# EAGLE design RLB_LTC5510 (EAGLE 9.3.1)
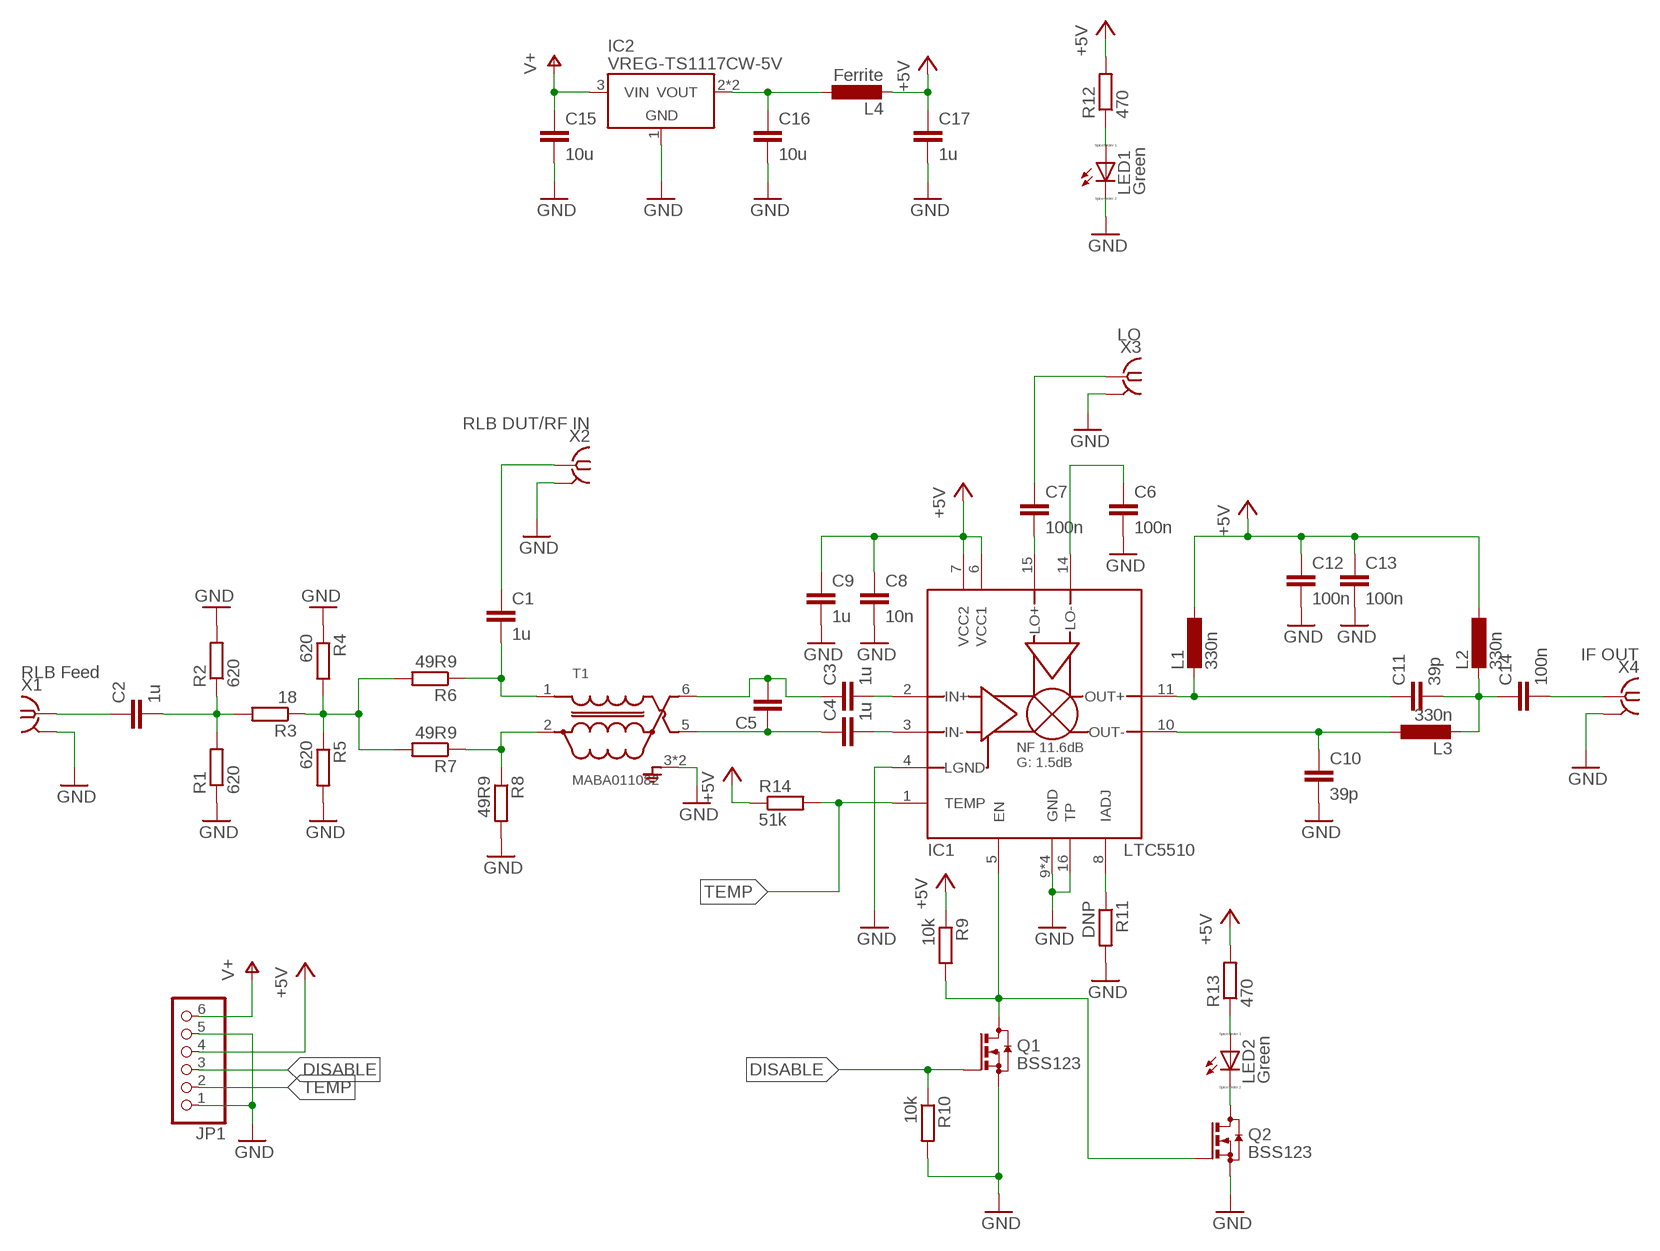
[diagram p0: schematic, sheet 1]

## Parts
C1  1u  C-EUC0603  [C0603]
C2  1u  C-EUC0603  [C0603]
C3  1u  C-EUC0603  [C0603]
C4  1u  C-EUC0603  [C0603]
C5  C-EUC0603  [C0603]
C6  100n  C-EUC0603  [C0603]
C7  100n  C-EUC0603  [C0603]
C8  10n  C-EUC0603  [C0603]
C9  1u  C-EUC0603  [C0603]
C10  39p  C-EUC0603  [C0603]
C11  39p  C-EUC0603  [C0603]
C12  100n  C-EUC0603  [C0603]
C13  100n  C-EUC0603  [C0603]
C14  100n  C-EUC0603  [C0603]
C15  10u  C-EUC1206  [C1206]
C16  10u  C-EUC1206  [C1206]
C17  1u  C-EUC0603  [C0603]
IC1  LTC5510  [QFN65P400X400X75-17T215N]
IC2  VREG-TS1117CW-5V  [SOT223]
JP1  PINHD-1X6/90  [1X06/90]
L1  330n  INDUCTOR0603  [R0603]
L2  330n  INDUCTOR0603  [R0603]
L3  330n  INDUCTOR0603  [R0603]
L4  Ferrite  INDUCTOR0603  [R0603]
LED1  Green  LED_ESML0603  [LED_SML0603]
LED2  Green  LED_ESML0603  [LED_SML0603]
Q1  BSS123  [SOT23]
Q2  BSS123  [SOT23]
R1  620  R-EU_R0603  [R0603]
R2  620  R-EU_R0603  [R0603]
R3  18  R-EU_R0603  [R0603]
R4  620  R-EU_R0603  [R0603]
R5  620  R-EU_R0603  [R0603]
R6  49R9  R-EU_R0603  [R0603]
R7  49R9  R-EU_R0603  [R0603]
R8  49R9  R-EU_R0603  [R0603]
R9  10k  R-EU_R0603  [R0603]
R10  10k  R-EU_R0603  [R0603]
R11  DNP  R-EU_R0603  [R0603]
R12  470  R-EU_R0603  [R0603]
R13  470  R-EU_R0603  [R0603]
R14  51k  R-EU_R0603  [R0603]
T1  MABA011082  [MACOM_BALUN]
X1  RLB Feed  SMA_CONNECTOR  [J502-ND-142-0711-821/826]
X2  RLB DUT/RF IN  SMA_CONNECTOR  [J502-ND-142-0711-821/826]
X3  LO  SMA_CONNECTOR  [J502-ND-142-0711-821/826]
X4  IF OUT  SMA_CONNECTOR  [J502-ND-142-0711-821/826]

## Nets
+5V: C8.1 C9.1 C12.1 C13.1 C17.1 IC1.6(VCC1) IC1.7(VCC2) JP1.4 L1.1 L2.1 L4.2 R9.1 R12.2 R13.2 R14.1
DISABLE: JP1.3 Q1.1(G) R10.1
GND: C6.2 C8.2 C9.2 C10.2 C12.2 C13.2 C15.2 C16.2 C17.2 IC1.4(LGND) IC1.9(GND) IC1.12(GND) IC1.13(GND) IC1.16(TP) IC1.17(GND) IC2.1(GND) JP1.1 JP1.5 LED1.C Q1.2(S) Q2.2(S) R1.1 R2.2 R4.1 R5.2 R8.2 R10.2 R11.2 T1.3(GND) T1.4(GND) X1.G@1 X1.G@2 X1.G@3 X1.G@4 X2.G@1 X2.G@2 X2.G@3 X2.G@4 X3.G@1 X3.G@2 X3.G@3 X3.G@4 X4.G@1 X4.G@2 X4.G@3 X4.G@4
GND1: LED2.C Q2.3(D)
N$1: C2.2 R1.2 R2.1 R3.2
N$2: R3.1 R4.2 R5.1 R6.2 R7.2
N$3: C2.1 X1.1
N$4: C1.2 R6.1 T1.1(PIN1)
N$5: R7.1 R8.1 T1.2(PIN2)
N$6: C1.1 X2.1
N$7: C3.2 IC1.2(IN+)
N$8: C4.2 IC1.3(IN-)
N$9: C4.1 C5.1 T1.5(PIN5)
N$10: C3.1 C5.2 T1.6(PIN6)
N$11: C6.1 IC1.14(LO-)
N$12: C7.2 IC1.15(LO+)
N$13: C7.1 X3.1
N$14: C11.1 IC1.11(OUT+) L1.2
N$15: C10.1 IC1.10(OUT-) L3.1
N$16: C11.2 C14.1 L2.2 L3.2
N$17: C14.2 X4.1
N$18: IC1.5(EN) Q1.3(D) Q2.1(G) R9.2
N$19: IC1.8(IADJ) R11.1
N$20: C16.1 IC2.2(VOUT) IC2.4(VOUT) L4.1
N$21: LED2.A R13.1
N$22: LED1.A R12.1
TEMP: IC1.1(TEMP) JP1.2 R14.2
V+: C15.1 IC2.3(VIN) JP1.6

## Library data of the parts
C1-C17 = rcl:C-EU: CAPACITOR, European symbol
IC1 = rf:LTC5510
IC2 = we-power:VREG: Voltage Regulators (LDOs, Switching Converters...) LDOs Taiwan Semi TS1117 800mA max 15V - compatible On Semi NCP1117 1A max 20V - compatible Diodes AP2111H 0.6A max 6V (0.25V@0.6A) - compatible Diodes AP2114H 1A max 6V (0.45V@1A) Taiwan Semi TS9011 250mA max 12V - compatible Diodes AP2210 300mA max 15V - compatible Microchip MCP1700 250mA max 6.5V - compatible Microchip MCP1702 250mA max 13V - compatible Microchip MCP1703 250mA max 16V - compatible Microchip MCP1754 150mA max 16V Taiwan Semi TS5204 150mA max 16V (low noise) DC/DC Converter Modules Recom R-78Ex.x-1.0-W36 1A max 28V - compatible CUI V78xx-2000 2A max 18V Murata OKI-78SR-x.x/1.5-W36 1.5A max 36V
JP1 = pinhead:PINHD-1X6: PIN HEADER
L1-L4 = rf:INDUCTOR
LED1 LED2 = eagle-ltspice:LED_E: LED Source: http://www.osram.convergy.de Source: www.luxeon.com Source: www.kingbright.com; SPICEMODEL: NONE; SPICEPREFIX: D; SPICETYPE: diode
Q1 Q2 = transistor-small-signal:BSS123: N-CHANNEL MOS FET
R1-R11 R14 = rcl:R-EU_: RESISTOR, European symbol
R12 R13 = resistor:R-EU_: RESISTOR, European symbol
T1 = rf:MABA011082
X1-X4 = rf:SMA_CONNECTOR

## Board
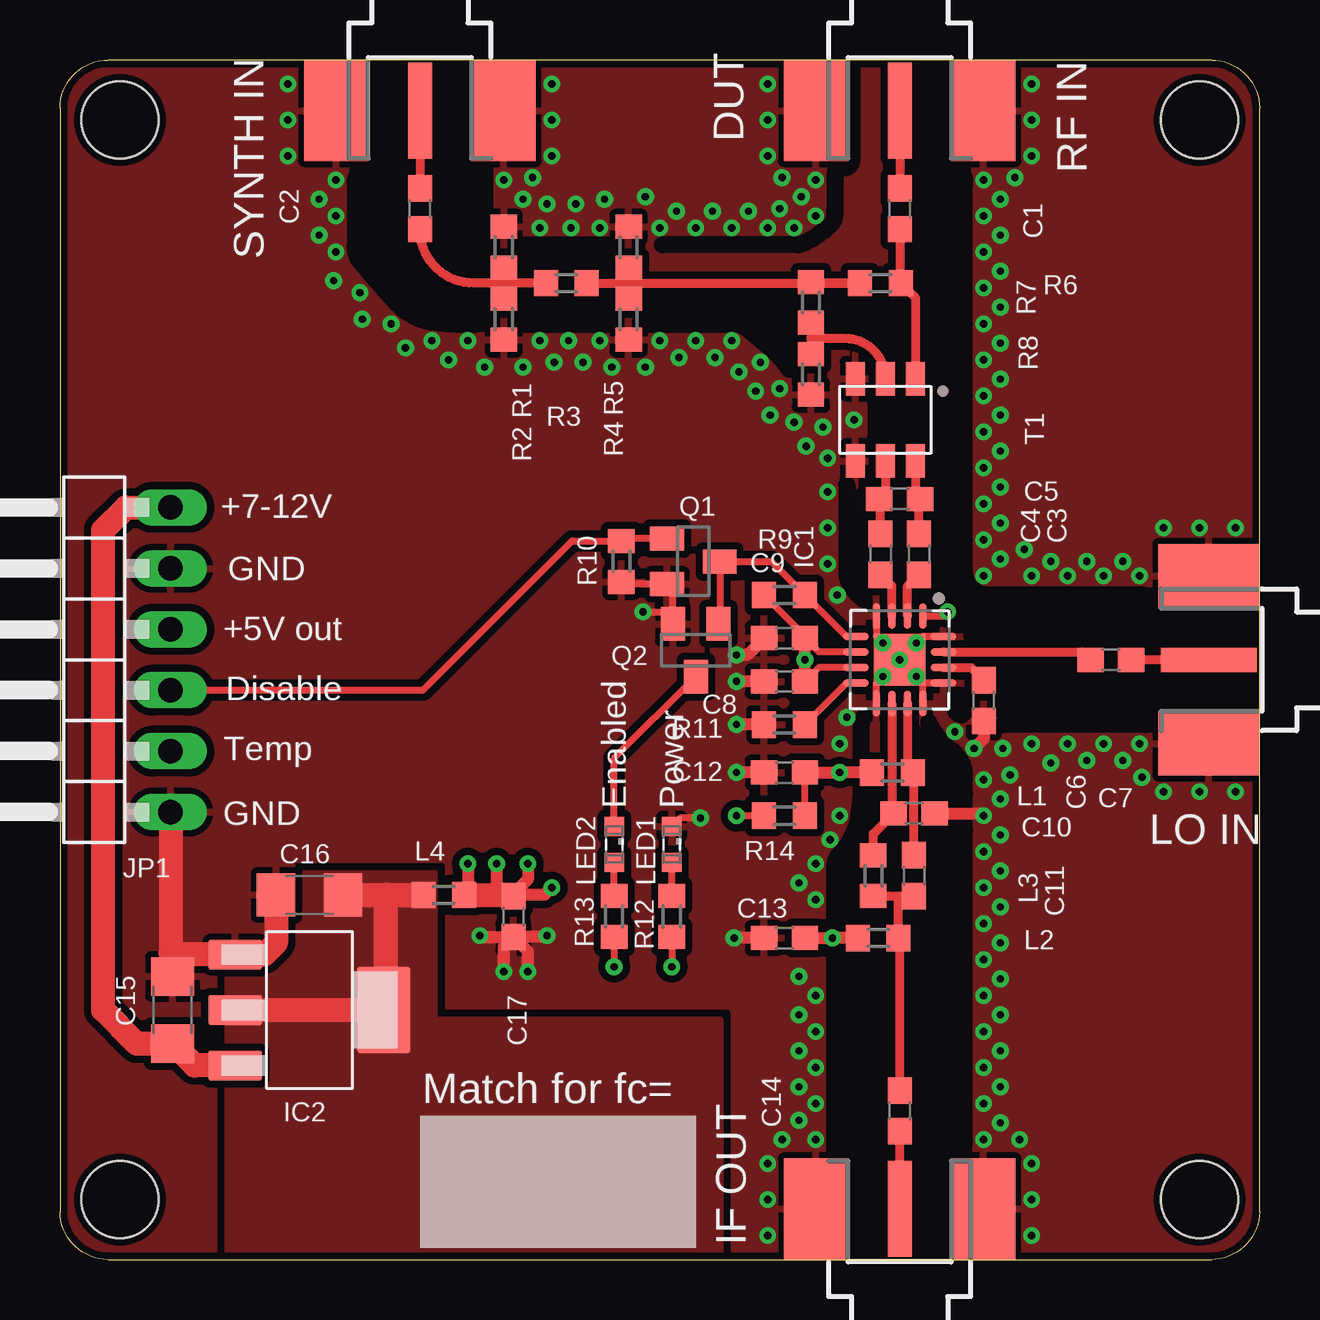
[diagram p1: board, top side]
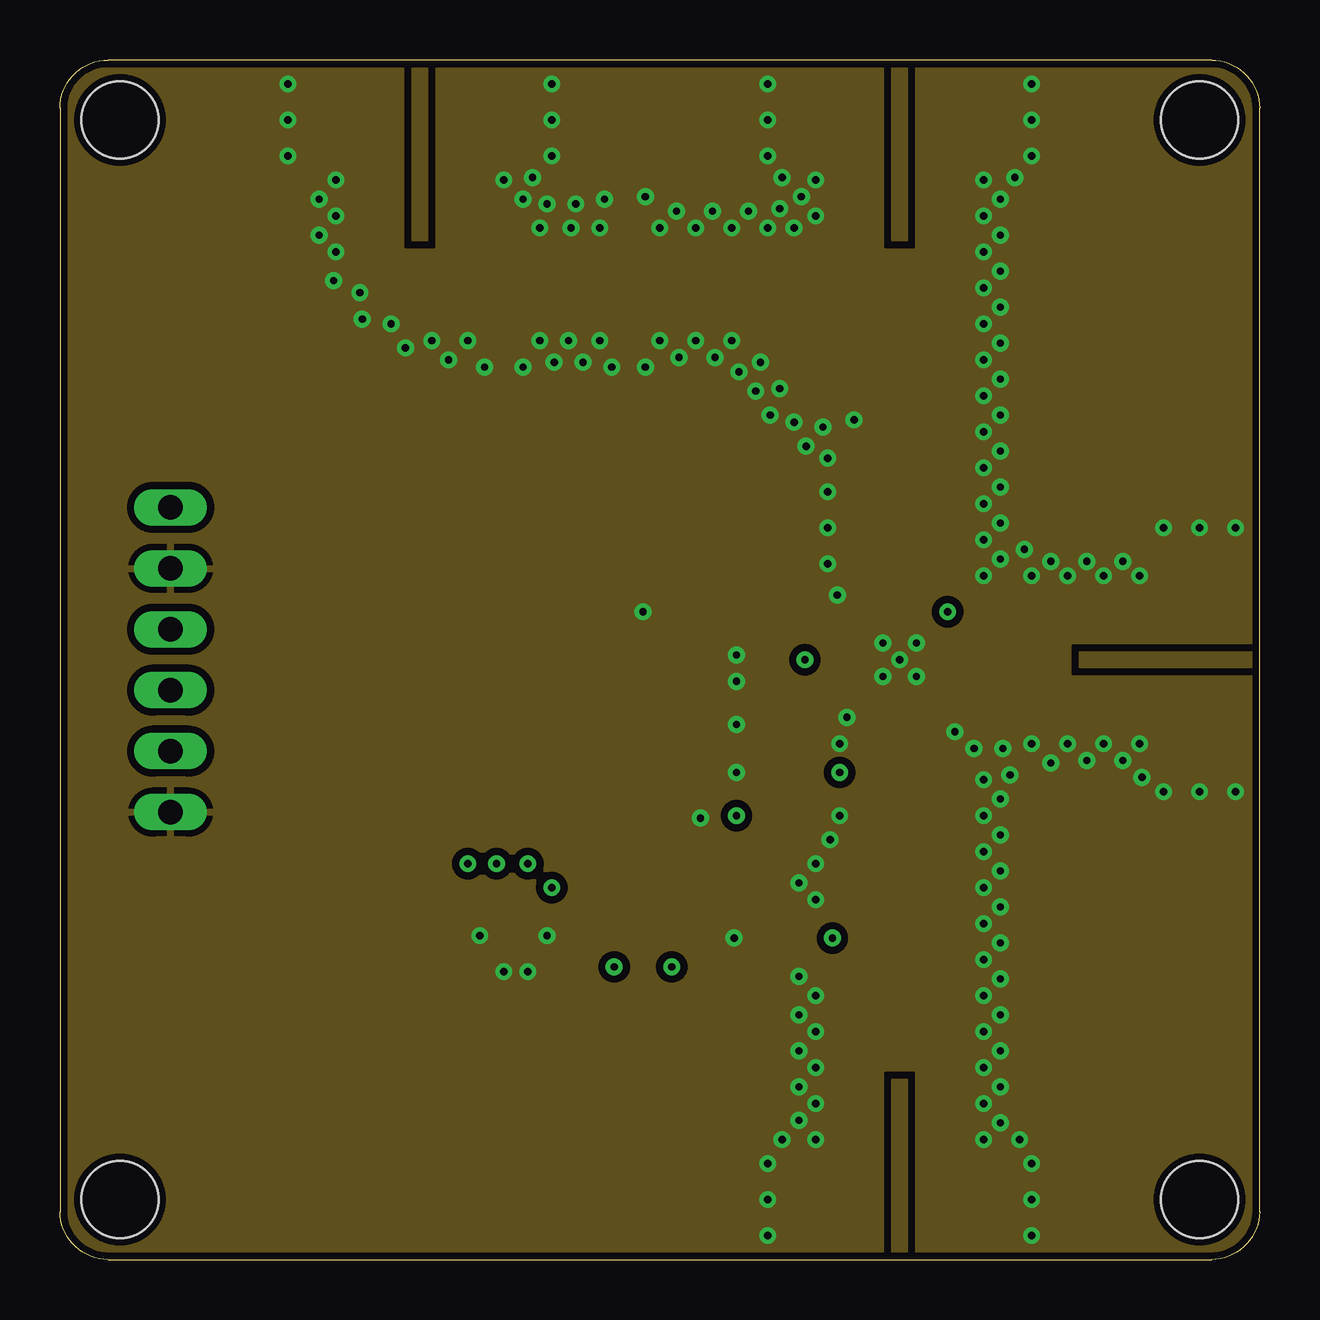
[diagram p2: board, inner layer Route2]
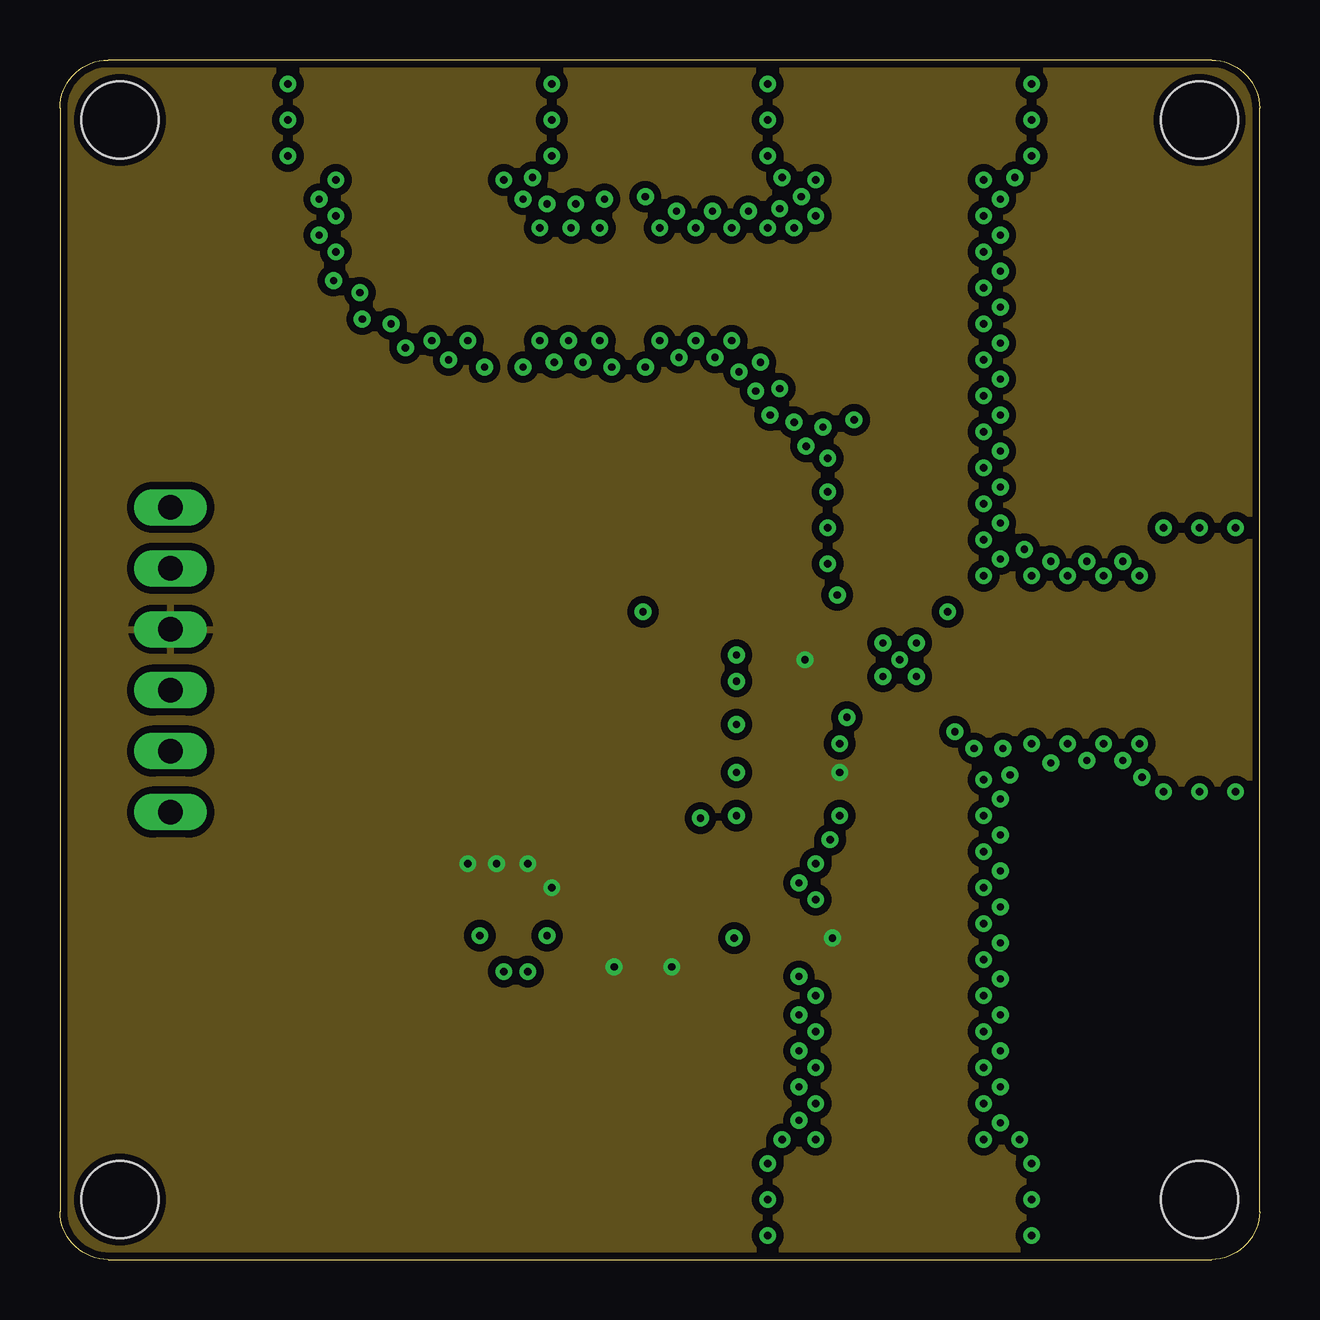
[diagram p3: board, inner layer Route15]
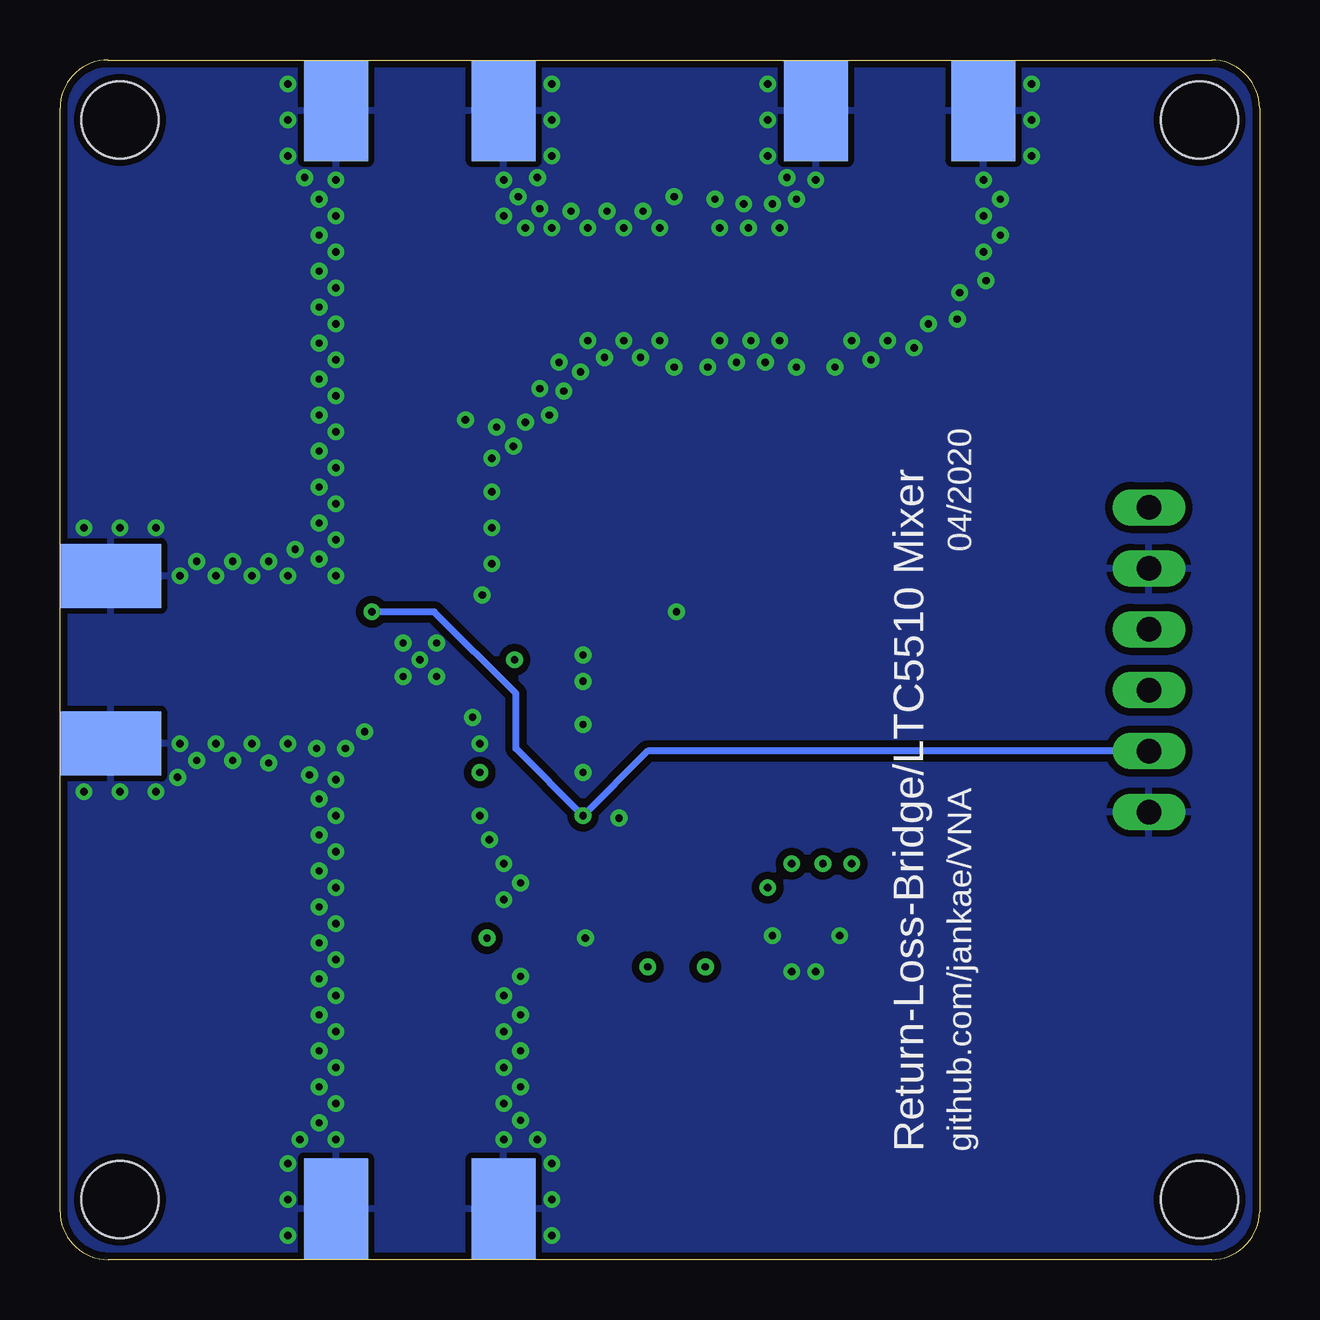
[diagram p4: board, bottom side, seen from below]

Size 50 x 50 mm. Coordinates in mm from the lower left corner, seen from the top.
Outline: 0,48 0,2 arc90 2,0 48,0 arc90 50,2 50,48 arc90 48,50 2,50 arc90 0,48
Copper layers (1+2*15+16): Top 0.035mm / dielectric 0.2mm / Route2 0.0175mm / dielectric 1.064mm / Route15 0.0175mm / dielectric 0.2mm / Bottom 0.035mm
Design rules "JLCPCB4L_7628": minimum track width 6mil, minimum drill 0.3mm, track to track 3.5mil, track to pad 3.5mil, pad to pad 3.5mil, via to via 3.5mil, smd to smd 0mil, copper to edge 0.2mm, drill to drill 0.2mm, minimum pad ring 10mil, minimum via ring 8mil, stop-mask expansion 4mil, vias tented up to drill 0mil, thermal gap 10mil
Holes 3.2 mm at 2.5,47.5 47.5,47.5 47.5,2.5 2.5,2.5
tRestrict: 72 lines

### Footprints (pad centres in the part's own frame; a part is rotated, then mirrored left to right if it is on the bottom)
C0603 = smd 1.1 x 1: 1 -0.85,0; 2 0.85,0
C1206 = smd 1.6 x 1.8: 1 -1.4,0; 2 1.4,0
QFN65P400X400X75-17T215N = smd 1.07 x 0.32: 1 -1.83,0.975; 2 -1.83,0.325; 3 -1.83,-0.325; 4 -1.83,-0.975; 9 1.83,-0.975; 10 1.83,-0.325; 11 1.83,0.325; 12 1.83,0.975 | smd 0.32 x 1.07: 5 -0.975,-1.83; 6 -0.325,-1.83; 7 0.325,-1.83; 8 0.975,-1.83; 13 0.975,1.83; 14 0.325,1.83; 15 -0.325,1.83; 16 -0.975,1.83 | smd 2.15 x 2.15: 17 0,0
SOT223 = smd 2.235 x 1.219: 1 -3.099,2.311; 2 -3.099,0; 3 -3.099,-2.311 | smd 2.2 x 3.6: 4 3.099,0
1X06/90 = drill 1.016 long: 1 -6.35,-3.81; 2 -3.81,-3.81; 3 -1.27,-3.81; 4 1.27,-3.81; 5 3.81,-3.81; 6 6.35,-3.81
R0603 = smd 1 x 1.1: 1 -0.85,0; 2 0.85,0
LED_SML0603 = smd 0.8 x 0.8: A 0.75,0; C -0.75,0
SOT23 = smd 1 x 1.4: 1 -0.95,-1.1; 2 0.95,-1.1; 3 0,1.1
MACOM_BALUN = smd 1.4 x 0.8: 1 -1.715,1.25; 2 -1.715,0; 3 -1.715,-1.25; 4 1.715,-1.25; 5 1.715,0; 6 1.715,1.25
J502-ND-142-0711-821/826 = smd 4 x 1: 1 2.115,0 | smd 4.191 x 2.667: G@1 2.115,3.495; G@2 2.115,-3.495 | smd 4.191 x 2.667 bottom: G@3 2.115,3.495; G@4 2.115,-3.495

### Placement (x,y rotation side)
C1  35,43.8 270 top
C2  15,43.8 270 top
C3  35.8,29.4 270 top
C4  34.2,29.4 270 top
C5  35,31.7 0 top
C6  38.5,23.3 270 top
C7  43.8,25 180 top
C8  30.2,24.1 180 top
C9  30.2,25.9 180 top
C10  35.6,18.6 0 top
C11  35.6,16 270 top
C12  30.2,20.3 180 top
C13  30.2,13.4 180 top
C14  35,6.2 270 top
C15  4.7,10.4 90 top
C16  10.4,15.2 180 top
C17  18.9,14.3 270 top
IC1  35,25 270 top
IC2  10.4,10.4 0 top
JP1  0.8,25 90 top
L1  34.7,20.3 0 top
L2  34.1,13.4 0 top
L3  33.9,16 270 top
L4  16,15.2 0 top
LED1  25.5,17.3 270 top
LED2  23.1,17.3 270 top
Q1  26.4,29.1 270 top
Q2  26.5,25.4 180 top
R1  18.5,42.2 270 top
R2  18.5,39.2 270 top
R3  21.1,40.7 180 top
R4  23.7,39.2 90 top
R5  23.7,42.2 90 top
R6  34.2,40.7 180 top
R7  31.3,39.9 90 top
R8  31.3,36.9 270 top
R9  30.2,27.7 0 top
R10  23.4,29.1 270 top
R11  30.2,22.3 180 top
R12  25.5,14.3 270 top
R13  23.1,14.3 270 top
R14  30.2,18.5 180 top
T1  34.4,35 270 top
X1  15,50 270 top
X2  35,50 270 top
X3  50,25 180 top
X4  35,0 90 top

### Tracks (layer width: path | path; a pad name or v marks a point on that pad's centre or on a via)
+5V  (via drill 0.3)
  Top 0.3: IC1.6 31.62,25.32 C9.1 31.05,26 R9.1 | IC1.7 31.62,24.68 C8.1 | R14.1 C12.1 | R12.2 v25.5,12.2 | R13.2 v23.1,12.2
  Top 0.5: L1.1 v32.5,20.3 C12.1 | L2.1 v32.2,13.4 C13.1 | C8.1 v31.05,25 C9.1 | v17,16.5 17,15.35 L4.2 | v18.2,16.5 18.2,15.2 | v19.5,16.5 19.5,15.85 18.85,15.2 20.2,15.2 v20.5,15.5
  Top 1: L4.2 18.2,15.2 18.85,15.2 C17.1
  pour Route15 (isolate 0.3): -1.8,52.2 53.3,52.2 53.3,-1.8 -1.8,-1.8
DISABLE
  Top 0.3: Q1.1 23.5,30.05 R10.1 21.35,29.95 15.13,23.73 JP1.3
DUMMY
  Route2 0: 46.4,2.3 46.4,2.9
  pour Route2 (isolate 0.3, rank 2): 50,25.3 42.5,25.3 42.5,24.7 50,24.7
  pour Route2 (isolate 0.3, rank 2): 34.7,50 34.7,42.5 35.3,42.5 35.3,50
  pour Route2 (isolate 0.3, rank 2): 14.7,50 14.7,42.5 15.3,42.5 15.3,50
  pour Route2 (isolate 0.3, rank 2): 35.3,0 35.3,7.5 34.7,7.5 34.7,0
GND  (via drill 0.3)
  Top 0.3: IC1.4 34.02,25.98 v34.3,25.7 IC1.17 | IC1.16 35.98,25.98 v35.7,25.7 IC1.17 | IC1.13 35.98,24.02 | 35.98,24.02 v35.7,24.3 | v35.7,24.3 IC1.17 | IC1.12 35.98,24.02 | 35.98,24.02 v35.7,24.3 | v35.7,24.3 IC1.17 | IC1.9 34.02,24.02 v34.3,24.3 IC1.17 | R10.2 23.5,28.15 Q1.2 25.55,27.9 25.55,26.8 | v26.7,18.4 25.85,18.4 LED1.C | Q2.2 25.55,26.8 | v24.3,27 25.35,27 25.55,26.8
  Top 0.5: C12.2 v28.2,20.3 | R11.2 v28.2,22.3 | C8.2 v28.2,24.1 | C9.2 28.65,25.2 v28.2,25.2 | v20.3,13.5 20.25,13.45 C17.2 | v17.5,13.5 17.55,13.45 C17.2 | v18.5,12 18.5,13.05 C17.2 | v19.5,12 19.5,12.85 C17.2 | C13.2 v28.1,13.4 | C10.2 38.4,18.6 v38.5,18.5 | C6.2 38.5,21.7 v38.1,21.3
  Top 1: JP1.1 4.61,12.8 | 4.61,12.8 4.61,11.89 C15.2 | 4.61,12.8 4.7,12.71 IC2.1 7.31,12.7 8.5,12.7 9,13.2 C16.2
  other vias: 35,25 9.5,49 9.5,47.5 9.5,46 11.5,45 11.5,43.5 11.5,42 17,38.3 15.5,38.3 13.8,39 12.5,40.3 20,38.3 22.5,38.3 21.2,38.3 18.5,45 20,43 22.5,43 21.3,43 31.5,45 31.5,43.5 25,43 26.5,43 28,43 29.5,43 30.6,43 25,38.3 26.5,38.3 28,38.3 29.2,37.4 30,36.3 30.6,34.9 31.8,34.7 33.1,35 10.8,44.2 10.8,42.7 11.4,40.8 12.6,39.2 14.4,38 16.2,37.5 17.7,37.2 19.3,37.2 23,37.2 24.4,37.2 19.3,44.2 22.7,44.2 24.4,44.3 25.7,43.7 27.2,43.7 28.7,43.7 30,43.8 30.9,44.3 20.5,49 20.5,47.5 20.5,46 19.7,45.1 20.3,44 21.5,44 29.5,49 29.5,47.5 29.5,46 30.1,45.1 25.8,37.6 27.3,37.6 28.3,37 29,36.2 29.6,35.2 31.1,33.9 32,33.4 40.5,49 40.5,47.5 40.5,46 38.5,45 38.5,43.5 38.5,42 38.5,40.5 38.5,39 38.5,37.5 38.5,36 38.5,34.5 38.5,33 38.5,31.5 38.5,30 38.5,28.5 45,28.5 43.5,28.5 42,28.5 40.5,28.5 49,30.5 47.5,30.5 46,30.5 44.3,29.1 42.8,29.1 41.3,29.1 39.2,29.2 39.2,30.7 39.2,32.2 39.2,33.7 39.2,35.2 39.2,36.7 39.2,38.2 39.2,39.7 39.2,41.2 39.2,42.7 39.2,44.2 39.8,45.1 40.2,29.6 49,19.5 47.5,19.5 46,19.5 45,21.5 43.5,21.5 42,21.5 40.5,21.5 39.3,21.3 37.3,22 40.5,1 40.5,2.5 40.5,4 38.5,5 38.5,6.5 38.5,8 38.5,9.5 38.5,11 38.5,12.5 38.5,14 38.5,15.5 38.5,17 38.5,20 39.2,5.7 39.2,7.2 39.2,8.7 39.2,10.2 39.2,11.7 39.2,13.2 39.2,14.7 39.2,16.2 39.2,17.7 39.2,19.2 39.6,20.2 41.3,20.7 42.8,20.8 44.3,20.8 45.1,20.1 40,5 29.5,1 29.5,2.5 29.5,4 31.5,5 31.5,6.5 31.5,8 31.5,9.5 31.5,11 31.5,15 31.5,16.5 32.5,18.5 30.8,5.8 30.8,7.2 30.8,8.7 30.8,10.2 30.8,11.8 30.1,5 32,32 32,30.5 32,29 32.4,27.7 20.6,37.4 21.8,37.4 30.8,15.7 32.1,17.5 32.5,21.5 32.8,22.6
  pour Route2 (isolate 0.3, rank 6): -1.3,51.7 54.4,51.7 54.4,-2.6 -1.3,-2.6
  pour Top (isolate 0.3, rank 2): -1.6,53.2 54.4,53.2 54.4,-3.3 -1.6,-3.3
  pour Bottom (isolate 0.3, rank 2): -1.7,51.5 52.6,51.5 52.6,-3.8 -1.7,-3.8
GND1
  Top 0.3: LED2.C 23.1,20.9 Q2.3
N$1
  Top 0.37: R3.2 18.5,40.7 | 18.5,40.7 17.25,40.7 arc-90 C2.2 | R1.2 18.5,40.7 | R2.1 18.5,40.7
N$2
  Top 0.37: R3.1 23.7,40.7 | 23.7,40.7 R6.2 31.35,40.7 R7.2 | R4.2 23.7,40.7 | R5.1 23.7,40.7
N$3
  Top 0.37: X1.1 C2.1
N$4
  Top 0.37: C1.2 35,40.75 R6.1 35.65,40.1 T1.1
N$5
  Top 0.37: R7.1 31.3,38.4 | 31.3,38.4 R8.1 | 31.3,38.4 32.72,38.4 arc-90 T1.2
N$6
  Top 0.37: X2.1 C1.1
N$7
  Top 0.37: IC1.2 35.33,28.07 C3.2
N$8
  Top 0.37: IC1.3 34.67,28.07 C4.2
N$9
  Top 0.37: C4.1 34.2,31.65 C5.1 34.4,31.95 T1.5
N$10
  Top 0.37: C3.1 35.8,31.65 C5.2 35.65,31.9 T1.6
N$11
  Top 0.37: IC1.14 37.98,24.68 C6.1
N$12
  Top 0.37: IC1.15 42.62,25.32 C7.2
N$13
  Top 0.37: X3.1 C7.1
N$14
  Top 0.37: IC1.11 35.33,20.52 L1.2 35.6,20.25 C11.1
N$15
  Top 0.37: IC1.10 34.67,18.68 C10.1 33.9,17.75 L3.1
N$16
  Top 0.37: C14.1 35,13.35 L2.2 34.95,15.1 35,15.15 | L3.2 35,15.15 | 35,15.15 C11.2
N$17
  Top 0.37: X4.1 C14.2
N$18
  Top 0.3: IC1.5 32.77,25.98 R9.2 29.65,29.1 Q1.3 27.5,26 27.5,26.45 Q2.1
N$19
  Top 0.3: IC1.8 32.77,24.02 R11.1
N$20
  Top 1: IC2.2 IC2.4 13.6,10.5 13.6,15.2 | C16.1 13.6,15.2 | 13.6,15.2 L4.1
  pour Top (isolate 0.3, no thermals): 7,-0.4 7,16.1 15.6,16.1 15.6,10 27.5,10 27.5,-1.4 7,-1.4
N$21
  Top 0.3: R13.1 LED2.A
N$22
  Top 0.3: R12.1 LED1.A
TEMP  (via drill 0.3)
  Top 0.3: IC1.1 36.83,26.83 v37,27 | R14.2 v28.2,18.5
  Bottom 0.3: v37,27 34.4,27 31,23.6 31,21.3 v28.2,18.5 25.51,21.19 JP1.2
V+
  Top 1: IC2.3 5.61,8.09 C15.1 3.2,9 1.8,10.4 1.8,30.4 2.75,31.35 JP1.6

### Text on the board
tPlace: DUT | RF IN | SYNTH IN | +7-12V | GND | +5V out | Disable | Temp | Enabled | Power | GND | LO IN | Match for fc= | IF OUT
bPlace: 04/2020 | github.com/jankae/VNA | Return-Loss-Bridge/LTC5510 Mixer